# EAGLE board tsunami (EAGLE 7.7.0)
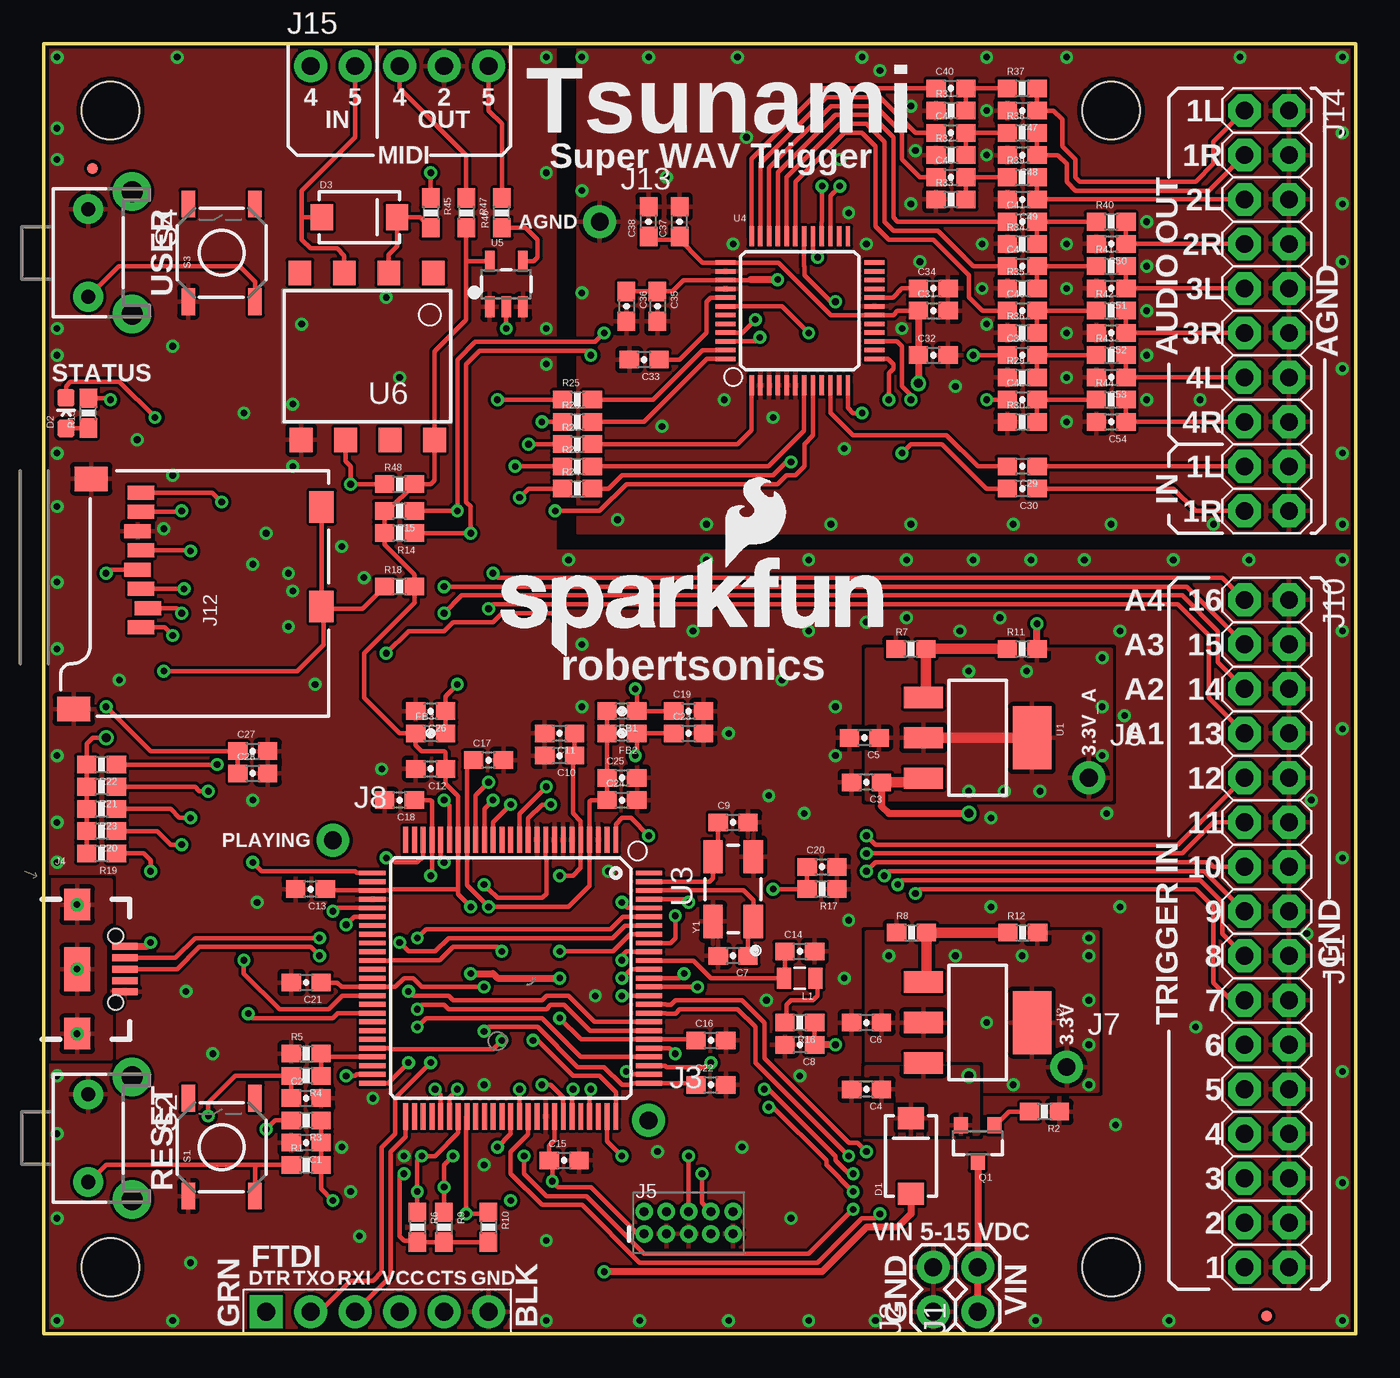
[diagram p2: board, top side]
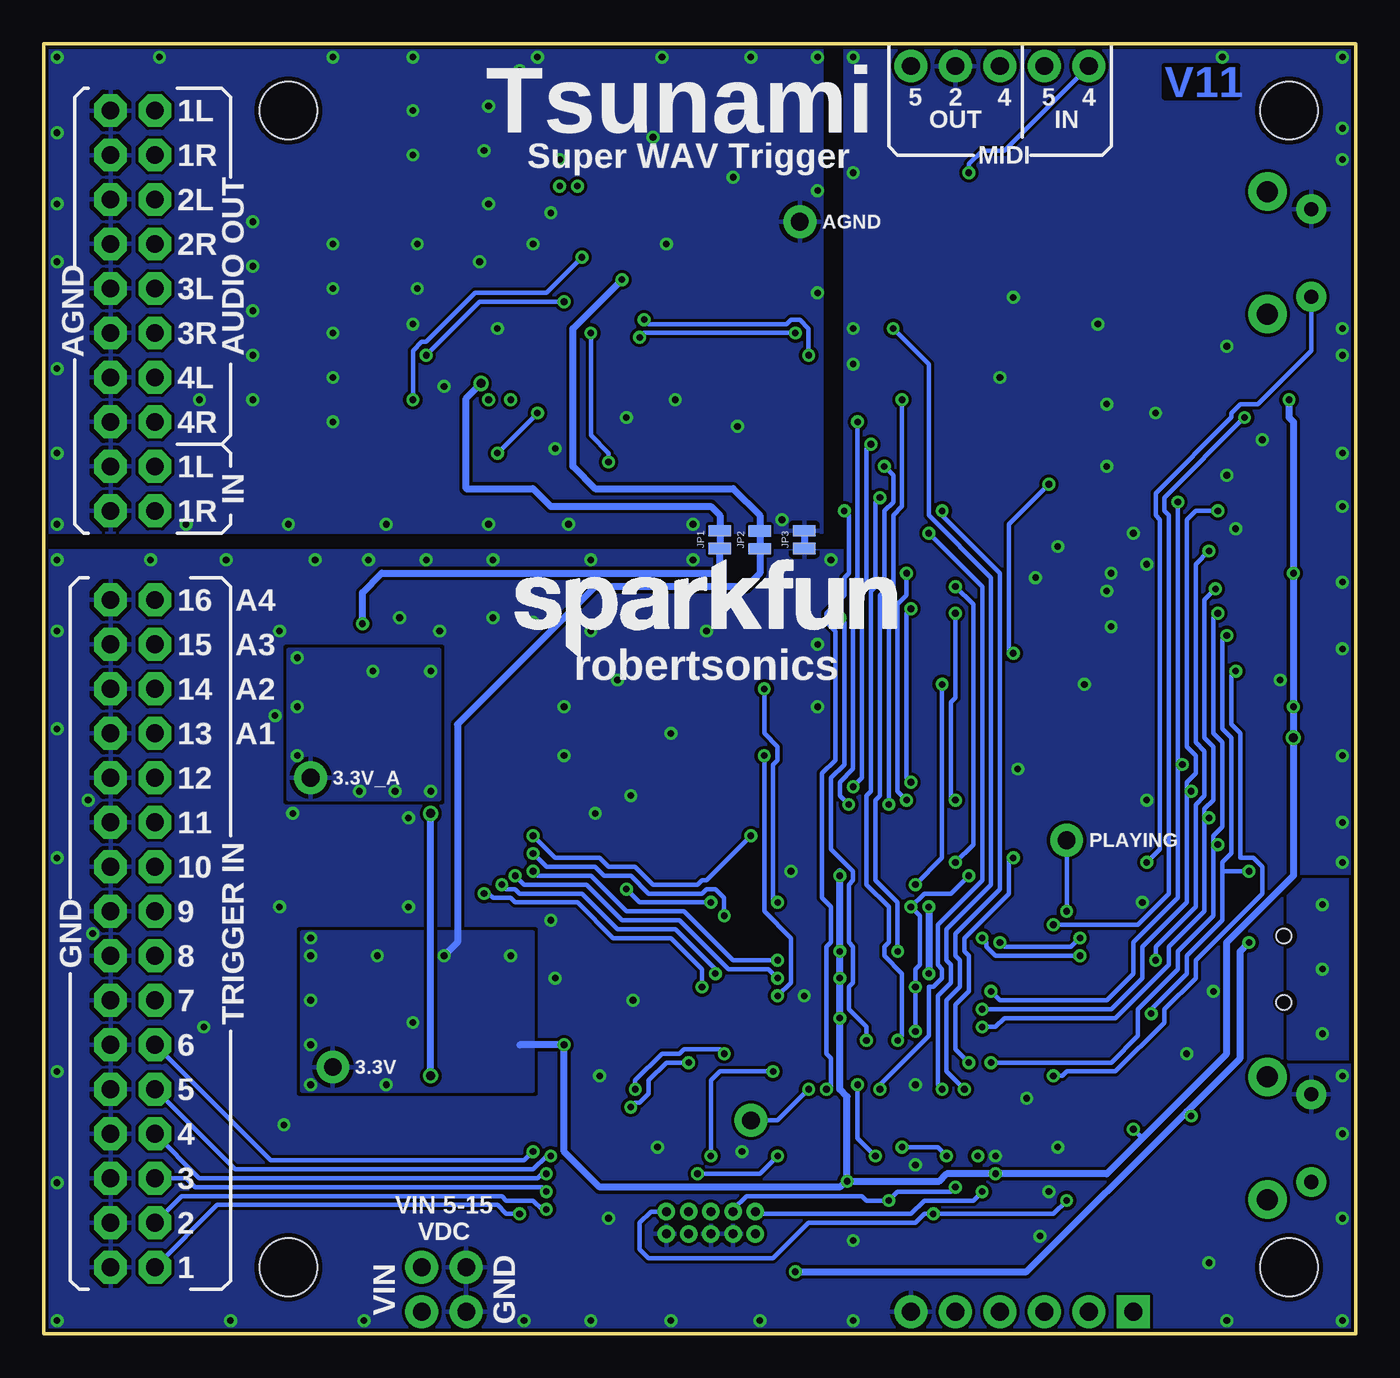
[diagram p3: board, bottom side, seen from below]

Size 74.93 x 73.66 mm. Coordinates in mm from the lower left corner, seen from the top.
Outline: 0,0 74.93,0 74.93,73.66 0,73.66 0,0
Copper layers (1*16): Top 0.035mm / dielectric 1.5mm / Bottom 0.035mm
Design rules "SparkFun-2-layer-TIGHT": minimum track width 7mil, minimum drill 15mil, track to track 7mil, track to pad 7mil, pad to pad 7mil, via to via 7mil, smd to smd 7mil, copper to edge 7mil, drill to drill 7mil, minimum pad ring 7mil, minimum via ring 7mil, stop-mask expansion 4mil, vias tented up to drill 20mil, thermal gap 10mil
tRestrict: area 41.1,53.7 to 41.3,54.5; area 41.7,53.7 to 41.8,54.5; area 42.2,53.7 to 42.3,54.5; area 42.7,53.7 to 42.8,54.5; area 29.3,27.8 to 29.5,28.6; area 29.8,27.8 to 30,28.6

## Footprints (pad centres in the part's own frame; a part is rotated, then mirrored left to right if it is on the bottom)
0603-CAP = smd 1.1 x 1: 1 -0.85,0; 2 0.85,0
SMA-DIODE = smd 1.27 x 1.47: A -2.15,0; C 2.15,0
LED-0603 = smd 1 x 1: A 0,-0.877; C 0,0.877
0603 = smd 1.1 x 1: 1 -0.85,0; 2 0.85,0
MICRO-FIDUCIAL = smd 0.635 x 0.635: 1 0,0
STAND-OFF = hole 3.302: 0,0
1X02 = drill 1.016 pad 1.88: 1 0,0; 2 2.54,0
1X01_NO_SILK = drill 1.016 pad 1.88: 1 0,0
USB-B-MICRO-SMD_V03 = smd 1.45 x 0.4: D+ 2.725,0; D- 2.725,0.65; GND 2.725,-1.3; ID 2.725,-0.65; VBUS 2.725,1.3 | smd 1.5 x 1.8: SHIELD1 0,3.685; SHIELD2 0,-3.685 | smd 1.5 x 2.5: SHIELD3 0,0 | hole 0.85: 2.2,1.9; 2.2,-1.9
2X5-PTH-1.27MM = drill 0.508 pad 1: 1 -2.54,-0.635; 2 -2.54,0.635; 3 -1.27,-0.635; 4 -1.27,0.635; 5 0,-0.635; 6 0,0.635; 7 1.27,-0.635; 8 1.27,0.635; 9 2.54,-0.635; 10 2.54,0.635
FTDI_DEVICE_SIDE = drill 1.016 pad 1.88 square: P$1 -6.35,0 | drill 1.016 pad 1.88: P$2 -3.81,0; P$3 -1.27,0; P$4 1.27,0; P$5 3.81,0; P$6 6.35,0
2X8 = drill 1.016 pad 1.88 octagon: 1 0,0; 2 0,2.54; 3 2.54,0; 4 2.54,2.54; 5 5.08,0; 6 5.08,2.54; 7 7.62,0; 8 7.62,2.54; 9 10.16,0; 10 10.16,2.54; 11 12.7,0; 12 12.7,2.54; 13 15.24,0; 14 15.24,2.54; 15 17.78,0; 16 17.78,2.54
MICRO-SD-SOCKET-SDIO = smd 1.8 x 1.4: CD1 11.92,0.4; CD2 6.22,0.4 | smd 0.8 x 1.5: CD/DAT3 6.13,10.3; CLK 9.43,10.7; CMD 7.23,10.7; DAT0 11.63,10.7; DAT1 12.73,10.7; DAT2 5.03,10.7; GND 10.53,10.9; VCC 8.33,10.9 | smd 1.4 x 1.9: GND1 0.37,14.55; GND3 13.52,13.55
2X10 = drill 1.016 pad 1.88 octagon: 1 -11.43,-1.27; 2 -11.43,1.27; 3 -8.89,-1.27; 4 -8.89,1.27; 5 -6.35,-1.27; 6 -6.35,1.27; 7 -3.81,-1.27; 8 -3.81,1.27; 9 -1.27,-1.27; 10 -1.27,1.27; 11 1.27,-1.27; 12 1.27,1.27; 13 3.81,-1.27; 14 3.81,1.27; 15 6.35,-1.27; 16 6.35,1.27; 17 8.89,-1.27; 18 8.89,1.27; 19 11.43,-1.27; 20 11.43,1.27
1X05_NO_SILK = drill 1.016 pad 1.88: 1 0,0; 2 2.54,0; 3 5.08,0; 4 7.62,0; 5 10.16,0
PAD-JUMPER-2-NC_BY_TRACE_NO_SILK = smd 0.635 x 1.27: 1 -0.508,0; 2 0.508,0
0805 = smd 0.8 x 1.2: 1 -0.9,0; 2 0.9,0
SOT23-3 = smd 0.8 x 0.9: 1 -0.95,-1; 2 0.95,-1; 3 0,1.1
0603-RES = smd 1.1 x 1: 1 -0.85,0; 2 0.85,0
TACTILE-SWITCH-SMD = smd 1.524 x 0.762: 1 -2.794,1.905; 2 2.794,1.905; 3 -2.794,-1.905; 4 2.794,-1.905
TACTILE-PTH-SIDEEZ = drill 0.8 pad 1.7: 1 -2.5,0; 2 2.5,0 | drill 1.2 pad 2.2: ANCHOR1 -3.5,2.5; ANCHOR2 3.5,2.5
TP_15TH = drill 0.381 pad 0.61: P$1 0,0
SOT223 = smd 1.219 x 2.235: 1 -2.311,-3.099; 2 0,-3.099; 3 2.311,-3.099 | smd 3.6 x 2.2: 4 0,3.099
LQFP100 = smd 1.5 x 0.28: 1 -7.9,6; 2 -7.9,5.5; 3 -7.9,5; 4 -7.9,4.5; 5 -7.9,4; 6 -7.9,3.5; 7 -7.9,3; 8 -7.9,2.5; 9 -7.9,2; 10 -7.9,1.5; 11 -7.9,1; 12 -7.9,0.5; 13 -7.9,0; 14 -7.9,-0.5; 15 -7.9,-1; 16 -7.9,-1.5; 17 -7.9,-2; 18 -7.9,-2.5; 19 -7.9,-3; 20 -7.9,-3.5; 21 -7.9,-4; 22 -7.9,-4.5; 23 -7.9,-5; 24 -7.9,-5.5; 25 -7.9,-6; 51 7.9,-6; 52 7.9,-5.5; 53 7.9,-5; 54 7.9,-4.5; 55 7.9,-4; 56 7.9,-3.5; 57 7.9,-3; 58 7.9,-2.5; 59 7.9,-2; 60 7.9,-1.5; 61 7.9,-1; 62 7.9,-0.5; 63 7.9,0; 64 7.9,0.5; 65 7.9,1; 66 7.9,1.5; 67 7.9,2; 68 7.9,2.5; 69 7.9,3; 70 7.9,3.5; 71 7.9,4; 72 7.9,4.5; 73 7.9,5; 74 7.9,5.5; 75 7.9,6 | smd 0.28 x 1.5: 26 -6,-7.9; 27 -5.5,-7.9; 28 -5,-7.9; 29 -4.5,-7.9; 30 -4,-7.9; 31 -3.5,-7.9; 32 -3,-7.9; 33 -2.5,-7.9; 34 -2,-7.9; 35 -1.5,-7.9; 36 -1,-7.9; 37 -0.5,-7.9; 38 0,-7.9; 39 0.5,-7.9; 40 1,-7.9; 41 1.5,-7.9; 42 2,-7.9; 43 2.5,-7.9; 44 3,-7.9; 45 3.5,-7.9; 46 4,-7.9; 47 4.5,-7.9; 48 5,-7.9; 49 5.5,-7.9; 50 6,-7.9; 76 6,7.9; 77 5.5,7.9; 78 5,7.9; 79 4.5,7.9; 80 4,7.9; 81 3.5,7.9; 82 3,7.9; 83 2.5,7.9; 84 2,7.9; 85 1.5,7.9; 86 1,7.9; 87 0.5,7.9; 88 0,7.9; 89 -0.5,7.9; 90 -1,7.9; 91 -1.5,7.9; 92 -2,7.9; 93 -2.5,7.9; 94 -3,7.9; 95 -3.5,7.9; 96 -4,7.9; 97 -4.5,7.9; 98 -5,7.9; 99 -5.5,7.9; 100 -6,7.9
LQFP-48 = smd 0.254 x 1.143: 1 -2.75,-4.25; 2 -2.25,-4.25; 3 -1.75,-4.25; 4 -1.25,-4.25; 5 -0.75,-4.25; 6 -0.25,-4.25; 7 0.25,-4.25; 8 0.75,-4.25; 9 1.25,-4.25; 10 1.75,-4.25; 11 2.25,-4.25; 12 2.75,-4.25; 25 2.75,4.25; 26 2.25,4.25; 27 1.75,4.25; 28 1.25,4.25; 29 0.75,4.25; 30 0.25,4.25; 31 -0.25,4.25; 32 -0.75,4.25; 33 -1.25,4.25; 34 -1.75,4.25; 35 -2.25,4.25; 36 -2.75,4.25 | smd 1.143 x 0.254: 13 4.25,-2.75; 14 4.25,-2.25; 15 4.25,-1.75; 16 4.25,-1.25; 17 4.25,-0.75; 18 4.25,-0.25; 19 4.25,0.25; 20 4.25,0.75; 21 4.25,1.25; 22 4.25,1.75; 23 4.25,2.25; 24 4.25,2.75; 37 -4.25,2.75; 38 -4.25,2.25; 39 -4.25,1.75; 40 -4.25,1.25; 41 -4.25,0.75; 42 -4.25,0.25; 43 -4.25,-0.25; 44 -4.25,-0.75; 45 -4.25,-1.25; 46 -4.25,-1.75; 47 -4.25,-2.25; 48 -4.25,-2.75
SOT23-5 = smd 0.55 x 1.2: 1 -0.95,-1.3; 2 0,-1.3; 3 0.95,-1.3; 4 0.95,1.3; 5 -0.95,1.3
8-SMD = smd 1.3 x 1.4: 1 -3.96,-4.96; 2 -1.42,-4.96; 3 1.12,-4.96; 4 3.66,-4.96; 5 3.59,4.58; 6 1.05,4.58; 7 -1.49,4.58; 8 -4.03,4.58
CRYSTAL-OSC-SMD-5X3 = smd 1.9 x 1.1: 1 -1.85,-1.15; 2 1.85,-1.15; 3 1.85,1.15; 4 -1.85,1.15

## Placement (x,y rotation side)
C1  10nF  [0603-CAP]  14.99,10.92 180 top
C2  10uF  [0603-CAP]  14.99,13.46 0 top
C3  0.1uF  [0603-CAP]  46.99,31.5 180 top
C4  0.1uF  [0603-CAP]  46.99,13.97 180 top
C5  10uF  [0603-CAP]  46.86,34.04 180 top
C6  10uF  [0603-CAP]  46.99,17.78 180 top
C7  12pF  [0603-CAP]  39.37,21.59 180 top
C8  0.1uF  [0603-CAP]  43.18,16.51 180 top
C9  12pF  [0603-CAP]  39.37,29.21 0 top
C10  0.1uF  [0603-CAP]  29.46,33.02 180 top
C11  10uF  [0603-CAP]  29.46,34.29 180 top
C12  0.1uF  [0603-CAP]  22.1,32.26 180 top
C13  0.1uF  [0603-CAP]  15.24,25.4 180 top
C14  4.7uF  [0603-CAP]  43.18,21.84 0 top
C15  0.1uF  [0603-CAP]  29.72,9.91 0 top
C16  0.1uF  [0603-CAP]  38.1,16.76 0 top
C17  0.1uF  [0603-CAP]  25.4,32.77 0 top
C18  0.1uF  [0603-CAP]  20.32,30.48 180 top
C19  0.1uF  [0603-CAP]  36.83,35.56 0 top
C20  10pF  [0603-CAP]  44.45,26.67 0 top
C21  0.1uF  [0603-CAP]  14.99,20.07 180 top
C22  0.1uF  [0603-CAP]  38.1,14.22 0 top
C23  0.1uF  [0603-CAP]  36.83,34.29 0 top
C24  0.1uF  [0603-CAP]  33.02,30.48 0 top
C25  2.2uF  [0603-CAP]  33.02,31.75 0 top
C26  0.1uF  [0603-CAP]  22.1,35.56 180 top
C27  10uF  [0603-CAP]  11.94,33.27 0 top
C28  0.1uF  [0603-CAP]  11.94,32 0 top
C29  1.0uF  [0603-CAP]  55.88,49.53 180 top
C30  1.0uF  [0603-CAP]  55.88,48.26 180 top
C31  0.1uF  [0603-CAP]  50.8,58.42 0 top
C32  1.0uF  [0603-CAP]  50.8,55.88 0 top
C33  1.0uF  [0603-CAP]  34.29,55.63 180 top
C34  1.0uF  [0603-CAP]  50.8,59.69 0 top
C35  0.1uF  [0603-CAP]  35.05,58.67 270 top
C36  1.0uF  [0603-CAP]  33.27,58.67 270 top
C37  0.1uF  [0603-CAP]  36.32,63.5 90 top
C38  1.0uF  [0603-CAP]  34.54,63.5 90 top
C39  1.0uF  [0603-CAP]  55.88,55.88 0 top
C40  1.0uF  [0603-CAP]  51.82,71.12 0 top
C41  1.0uF  [0603-CAP]  55.88,63.5 0 top
C42  1.0uF  [0603-CAP]  55.88,53.34 0 top
C43  1.0uF  [0603-CAP]  51.82,68.58 0 top
C44  1.0uF  [0603-CAP]  55.88,60.96 0 top
C45  1.0uF  [0603-CAP]  51.82,66.04 0 top
C46  1.0uF  [0603-CAP]  55.88,58.42 0 top
C47  0.1uF  [0603-CAP]  55.88,69.85 180 top
C48  0.1uF  [0603-CAP]  55.88,67.31 180 top
C49  0.1uF  [0603-CAP]  55.88,64.77 180 top
C50  0.1uF  [0603-CAP]  60.96,62.23 180 top
C51  0.1uF  [0603-CAP]  60.96,59.69 180 top
C52  0.1uF  [0603-CAP]  60.96,57.15 180 top
C53  0.1uF  [0603-CAP]  60.96,54.61 180 top
C54  0.1uF  [0603-CAP]  60.96,52.07 180 top
D1  MBRA140  [SMA-DIODE]  49.53,10.16 90 top
D2  BLUE  [LED-0603]  1.27,52.58 0 top
D3  MBRA140  [SMA-DIODE]  18.03,63.75 0 top
FB1  470  [0603]  33.02,35.56 180 top
FB2  470  [0603]  33.02,34.29 180 top
FB3  470  [0603]  22.1,34.29 0 top
FD1  FIDUCIALUFIDUCIAL  [MICRO-FIDUCIAL]  69.85,1.02 0 top
FD2  FIDUCIALUFIDUCIAL  [MICRO-FIDUCIAL]  2.79,66.55 0 top
FRAME1  FRAME-LEDGER  [CREATIVE_COMMONS]  -1.27,-31.75 0 top  (outside the outline)
FRAME2  FRAME-LEDGER  [CREATIVE_COMMONS]  -1.27,-31.75 0 top  (outside the outline)
H1  STAND-OFF  [STAND-OFF]  3.81,69.85 0 top
H2  STAND-OFF  [STAND-OFF]  60.96,3.81 0 top
H3  STAND-OFF  [STAND-OFF]  3.81,3.81 0 top
H4  STAND-OFF  [STAND-OFF]  60.96,69.85 0 top
J1  VDC-IN  [1X02]  53.34,1.27 90 top
J2  GND-IN  [1X02]  50.8,1.27 90 top
J3  DEBUG  [1X01_NO_SILK]  34.54,12.19 0 top
J4  USB-MICROB"  [USB-B-MICRO-SMD_V03]  1.91,20.83 0 top
J5  CORTEX_DEBUGPTH  [2X5-PTH-1.27MM]  36.83,6.35 0 top
J6  3.3VA  [1X01_NO_SILK]  59.69,31.75 0 top
J7  3.3V  [1X01_NO_SILK]  58.42,15.24 0 top
J8  PLAYING  [1X01_NO_SILK]  16.51,28.19 0 top
J9  FTDI_DEVICE  [FTDI_DEVICE_SIDE]  19.05,1.27 0 top
J10  TRIG2  [2X8]  68.58,41.91 270 top
J11  TRIG1  [2X8]  68.58,21.59 270 top
J12  USD-SDIO-SOCKET  [MICRO-SD-SOCKET-SDIO]  16.26,35.31 90 top
J13  GND  [1X01_NO_SILK]  31.75,63.5 0 top
J14  AUDIO I/O  [2X10]  69.85,58.42 270 top
J15  MIDI  [1X05_NO_SILK]  15.24,72.39 0 top
JP1  JUMPER-PAD-2-NC_BY_TRACENO_SILK  [PAD-JUMPER-2-NC_BY_TRACE_NO_SILK]  36.32,45.35 90 bottom
JP2  JUMPER-PAD-2-NC_BY_TRACENO_SILK  [PAD-JUMPER-2-NC_BY_TRACE_NO_SILK]  34.04,45.34 90 bottom
JP3  JUMPER-PAD-2-NC_BY_TRACENO_SILK  [PAD-JUMPER-2-NC_BY_TRACE_NO_SILK]  31.5,45.35 90 bottom
L1  10uH  [0805]  43.18,20.32 180 top
LOGO1  SFE_LOGO_NAME.2_INCH  [SFE_LOGO_NAME_.2]  48.01,38.61 0 bottom
LOGO4  SFE_LOGO_NAME_FLAME.2_INCH  [SFE_LOGO_NAME_FLAME_.2]  25.4,38.61 0 top
Q1  2.5A/30V  [SOT23-3]  53.34,10.92 180 top
R1  33  [0603-RES]  14.99,9.65 0 top
R2  1M  [0603-RES]  57.15,12.7 180 top
R3  10K  [0603-RES]  14.99,12.19 180 top
R4  15K  [0603-RES]  14.99,14.73 180 top
R5  22K  [0603-RES]  14.99,16 0 top
R6  100k  [0603-RES]  21.34,6.1 270 top
R7  390  [0603-RES]  49.53,39.12 0 top
R8  390  [0603-RES]  49.56,22.91 0 top
R9  100k  [0603-RES]  22.86,6.1 270 top
R10  100k  [0603-RES]  25.4,6.1 270 top
R11  240  [0603-RES]  55.88,39.12 0 top
R12  240  [0603-RES]  55.91,22.91 0 top
R13  330  [0603-RES]  2.54,52.58 90 top
R14  4.7K  [0603-RES]  20.32,45.72 180 top
R15  4.7K  [0603-RES]  20.32,46.99 180 top
R16  2.2  [0603-RES]  43.18,17.78 180 top
R17  5.62k  [0603-RES]  44.45,25.4 180 top
R18  10K  [0603-RES]  20.32,42.67 0 top
R19  100k  [0603-RES]  3.3,27.43 180 top
R20  100k  [0603-RES]  3.3,28.7 180 top
R21  100k  [0603-RES]  3.3,31.24 180 top
R22  100k  [0603-RES]  3.3,32.51 180 top
R23  10K  [0603-RES]  3.3,29.97 180 top
R24  100  [0603-RES]  30.48,48.26 0 top
R25  100  [0603-RES]  30.48,53.34 0 top
R26  100  [0603-RES]  30.48,52.07 0 top
R27  100  [0603-RES]  30.48,50.8 0 top
R28  100  [0603-RES]  30.48,49.53 0 top
R29  100k  [0603-RES]  55.88,54.61 0 top
R30  100k  [0603-RES]  55.88,52.07 0 top
R31  100k  [0603-RES]  51.82,69.85 0 top
R32  100k  [0603-RES]  51.82,67.31 0 top
R33  100k  [0603-RES]  51.82,64.77 0 top
R34  100k  [0603-RES]  55.88,62.23 0 top
R35  100k  [0603-RES]  55.88,59.69 0 top
R36  100k  [0603-RES]  55.88,57.15 0 top
R37  10  [0603-RES]  55.88,71.12 0 top
R38  10  [0603-RES]  55.88,68.58 0 top
R39  10  [0603-RES]  55.88,66.04 0 top
R40  10  [0603-RES]  60.96,63.5 0 top
R41  10  [0603-RES]  60.96,60.96 0 top
R42  10  [0603-RES]  60.96,58.42 0 top
R43  10  [0603-RES]  60.96,55.88 0 top
R44  10  [0603-RES]  60.96,53.34 0 top
R45  220  [0603-RES]  22.1,64.01 270 top
R46  220  [0603-RES]  26.16,64.01 90 top
R47  220  [0603-RES]  24.13,64.01 270 top
R48  220  [0603-RES]  20.32,48.51 0 top
S1  Reset  [TACTILE-SWITCH-SMD]  10.16,10.67 90 top
S2  DNS  [TACTILE-PTH-SIDEEZ]  2.54,11.18 270 top
S3  User  [TACTILE-SWITCH-SMD]  10.16,61.72 90 top
S4  DNS  [TACTILE-PTH-SIDEEZ]  2.54,61.72 270 top
TP1  AIN2L  [TP_15TH]  48.26,53.34 0 top
TP2  AIN2R  [TP_15TH]  49.53,53.34 0 top
TP3  AOUT5L  [TP_15TH]  44.45,65.53 90 top
TP4  AOUT5R  [TP_15TH]  45.47,65.53 90 top
TP5  SWDIO/TMS  [TP_15TH]  21.59,10.16 90 top
TP6  SWCK/TCK  [TP_15TH]  26.67,7.62 90 top
TP7  TDO  [TP_15TH]  36.83,10.16 90 top
TP8  TDI  [TP_15TH]  33.02,10.16 90 top
TP9  NRESET  [TP_15TH]  16.51,7.62 0 top
U1  LM1117  [SOT223]  53.34,34.04 270 top
U2  LM1117  [SOT223]  53.34,17.78 270 top
U3  ATSAMS70N20A-AN  [LQFP100]  26.67,20.32 270 top
U4  AK4618VQ  [LQFP-48]  43.18,58.42 0 top
U5  74AHC1G125  [SOT23-5]  26.42,59.94 0 top
U6  6N138M  [8-SMD]  18.29,55.63 180 top
Y1  11.2896 MHz  [CRYSTAL-OSC-SMD-5X3]  39.37,25.4 90 top

## Tracks (layer width: path | path; a pad name or v marks a point on that pad's centre or on a via)
3.3V  (via drill 0.38, 0.51)
  Top 0.254: C16.1 37.19,16.82 U3.81 30.68,16.82 v29.46,18.03 | C11.1 C10.1 30.23,32.93 30.23,29.72 30.67,29.27 U3.5 30.67,26.61 30.23,26.16 v29.46,26.16 | R16.1 C8.1 | C36.1 C35.1 35.9,59.52 36.55,60.17 U4.39 40.36,60.17 40.39,60.2 | C13.1 16.17,25.32 U3.28 19.73,25.32 19.81,25.4 23.67,25.4 | C28.1 C27.1 6.1,33.27 v3.56,35.81 | U3.93 33.49,22.82 32.51,21.84 v29.46,21.84 | 23.67,25.4 U3.19 23.67,30.69 22.95,31.41 C12.1 22.95,33.19 22.86,33.27 21.59,33.27 21.25,33.62 FB3.1 20.32,34.29 18.29,36.32 18.29,38.86 21.17,41.74 R18.2 21.17,43.35 19.47,45.05 R14.2 R15.2 19.65,46.99 R48.2 22.1,48.51 22.32,48.73 U6.8 22.32,56.1 24.13,57.91 24.13,61.21 | 23.67,25.4 23.67,25.1 v24.38,24.38 | J12.VCC 3.76,43.64 v3.56,43.43 | R13.2 3.72,53.43 v3.81,53.34 | R19.2 R20.2 R23.2 R21.2 R22.2 2.45,33.69 2.79,34.04 v3.56,34.04 | R10.2 22.95,5.25 22.86,5.33 R9.2 R6.2 21.34,5.33 20.57,5.33 20.32,5.59 20.32,9.14 v20.57,9.14 | U3.68 29.17,11.05 28.87,10.75 C15.1 29.04,9.73 v29.04,8.72 29.39,8.38 31.24,8.38 33.91,5.71 J5.1 | R3.2 13.21,12.19 v12.7,11.68 | U5.5 24.16,61.24 24.13,61.21 | 24.13,61.21 R47.2
  Top 0.406: C36.1 33.11,59.69 | v45.21,16.51 C8.1 | v41.91,60.2 40.39,60.2 | v24.38,20.57 25.65,20.57 25.91,20.32 v29.46,20.32
  Top 0.61: 56.76,18.12 arc-90 U2.4
  Bottom 0.254: v12.7,11.68 12.19,11.18
  Bottom 0.406: v29.04,8.72 29.12,8.72 29.46,8.38 43.18,8.38 45.21,10.41 v45.21,16.51 47.75,16.51 | v41.91,60.2 44.7,57.4 44.7,49.53 43.43,48.26 35.56,48.26 34.04,46.74 JP2.2 JP2.1 34.04,43.43 34.8,42.67 43.43,42.67 51.31,34.8 51.31,22.35 v52.07,21.59 | v29.04,8.72 29.04,13.55 29.46,13.97 v29.46,18.03 v29.46,20.32 v29.46,21.84 v29.46,26.16 29.46,26.42 | v24.38,24.38 v24.38,20.57 | v3.81,53.34 3.81,52.32 3.56,52.07 v3.56,43.43 v3.56,35.81 v3.56,34.04 3.56,26.16 7.37,22.35 7.37,16 12.19,11.18 14.22,9.14 v20.57,9.14 23.37,9.14 23.79,8.72 v29.04,8.72
  other vias: 53.85,17.78 59.69,14.22 55.37,14.22 59.69,16.51 59.69,19.05 59.69,21.59 55.88,21.59 48.26,21.59 59.69,22.61
  pour Top (rank 2): 46.99,13.84 46.99,22.99 60.2,22.99 60.2,13.84
  pour Bottom: 60.2,13.84 60.2,22.99 46.99,22.99 46.99,13.84
56
  Top 0.254: R45.2 21.5,63.75 D3.C 20.18,62.09 19.71,61.62 U6.2
AIN1L
  Top 0.254: C29.1 J14.17
AIN1R
  Top 0.254: J14.19 65.79,46.99 64.52,48.26 C30.1
AIN2L
  Top 0.254: U4.13 48.22,55.67 48.51,55.37 48.51,55.12 48.26,54.86 TP1.P$1
AIN2R
  Top 0.254: U4.15 48.74,56.67 49.02,56.39 49.02,54.1 49.53,53.59 TP2.P$1
AOUT1L
  Top 0.254: R37.2 C47.1 57.66,69.85 58.17,69.34 58.17,67.82 58.93,67.06 58.93,66.04 59.18,65.79 65.79,65.79 66.8,66.8 66.8,68.07 J14.1
AOUT1R
  Top 0.254: R38.2 C48.1 57.91,67.31 58.42,66.8 58.42,65.79 58.93,65.28 66.55,65.28 J14.3
AOUT2L
  Top 0.254: R39.2 C49.1 J14.5
AOUT2R
  Top 0.254: R40.2 C50.1 J14.7
AOUT3L
  Top 0.254: R41.2 C51.1 J14.9
AOUT3R
  Top 0.254: R42.2 C52.1 J14.11
AOUT4L
  Top 0.254: R43.2 C53.1 J14.13
AOUT4R
  Top 0.254: C54.1 61.81,52.58 | 61.81,52.58 R44.2 | J14.15 62.32,52.07 61.81,52.58
APDN  (via drill 0.38)
  Top 0.254: U3.70 30.17,13.66 30.23,13.72 v30.23,13.97 | v29.21,46.99 31.75,46.99 33.27,48.51 41.91,48.51 42.42,49.02 42.93,49.02 43.43,49.53 43.43,50.8 43.94,51.31 43.94,53.34 43.93,53.35 U4.8
  Bottom 0.254: v30.23,13.97 29.97,13.97 29.97,15.75 30.23,16 30.23,22.1 29.97,22.35 29.97,24.38 30.48,24.89 30.48,32 29.72,32.77 29.72,40.13 30.23,40.64 30.23,41.15 29.21,42.16 29.21,43.18 28.96,43.43 28.96,46.74 v29.21,46.99
BCLK  (via drill 0.38)
  Top 0.254: U3.11 27.67,29.45 28.45,30.23 v28.96,30.23 | R26.1 v28.45,52.07
  Bottom 0.254: v28.96,30.23 29.46,30.73 29.46,31.5 28.7,32.26 28.7,42.93 28.45,43.18 v28.45,52.07
BCLK_C
  Top 0.254: U4.48 37.89,55.67 34.29,52.07 R26.2
DBUG  (via drill 0.38)
  Top 0.254: U3.72 31.17,13.9 v31.24,13.97
  Bottom 0.254: J3.1 33.02,12.19 v31.24,13.97
GND  (via drill 0.38)
  Top 0.254: 43.24,14.79 v43.18,14.73
  Bottom 0.406: JP3.2 JP3.1
  other vias: 53.59,59.69 62.99,58.42 62.99,60.96 62.99,63.5 62.99,55.88 62.99,53.34 47.75,72.14 40.13,68.33 45.97,64.01 46.99,62.23 45.47,67.06 49.02,57.4 7.37,0.76 0.76,6.6 39.12,0.76 43.69,0.76 30.73,35.81 32.26,26.42 39.12,34.29 42.16,37.34 46.99,40.64 52.32,40.13 45.21,35.81 45.21,33.02 41.4,30.73 43.43,29.72 61.47,40.13 59.44,44.2 56.39,44.2 53.09,44.2 49.28,44.2 43.69,44.2 37.85,44.2 29.97,44.2 14.22,53.09 19.56,59.18 14.22,49.53 13.97,43.43 18.29,43.18 0.76,67.06 20.32,54.61 53.85,57.66 52.07,54.1 32.77,46.48 37.85,46.23 49.53,46.23 66.8,46.23 66.04,53.34 39.37,62.23 30.73,65.28 30.73,72.9 35.56,66.04 39.62,72.9 46.74,72.9 53.85,72.9 74.17,64.52 74.17,68.58 74.17,55.12 74.17,50.29 74.17,40.13 68.83,44.2 74.17,44.2 45.72,50.55 28.7,66.29 28.7,72.9 7.62,72.9 0.76,68.83 74.17,34.54 74.17,27.18 74.17,14.99 74.17,8.64 30.73,39.37 37.08,40.13 43.69,40.13 49.28,40.89 54.61,40.89 17.02,44.96 0.76,47.24 74.17,72.9 74.17,46.23 74.17,0.76 64.26,0.76 0.76,0.76 0.76,39.12 0.76,33.02 4.32,37.34 0.76,42.93 11.94,43.94 12.7,45.72 14.22,42.42 13.97,40.39 11.94,30.48 8.38,4.06 72.39,30.48 72.14,22.86 5.33,51.05 7.37,49.02 6.86,45.97 58.42,62.23 58.42,59.69 58.42,57.15 58.42,54.61 58.42,52.07 17.02,10.67 17.53,8.13 45.72,20.32 42.67,6.6 39.88,10.67 28.7,5.33 25.15,14.22 31.5,19.3 28.7,57.4 28.7,55.37 49.53,70.1 49.53,64.52 49.78,67.56 53.85,69.85 53.85,67.31 53.59,62.23 0.76,72.9 0.76,57.4 0.76,55.88 7.37,56.39 11.43,52.58 14.73,57.66 0.76,29.21 0.76,26.92 34.04,0.76 28.7,0.76 47.5,0.76 35.05,10.41 25.15,9.65 20.57,10.16 18.8,13.46 18.03,5.59 56.64,0.76 61.21,11.94 65.79,17.53 61.47,24.38 54.1,24.38 45.97,23.62 54.1,29.46 60.71,29.72 61.72,35.31 64.52,44.2 60.96,46.23 55.37,46.23 44.96,46.23 74.17,61.21 68.33,72.9 58.42,72.9 30.73,59.44 50.04,61.21 41.66,52.32 38.86,53.34 35.31,51.82 19.3,32.26 15.49,37.08 12.19,24.64 8.13,19.56 9.65,16 41.27,19.05 0.76,50.29 0.76,11.43 0.76,14.73 34.54,72.9
  pour Top (rank 3): 0,73.66 29.21,73.66 29.21,44.72 74.93,44.72 74.93,0 0,0
  pour Top: 30.48,73.66 30.48,45.74 74.93,45.74 74.93,73.66
  pour Bottom (rank 2): 0,73.66 29.21,73.66 29.21,44.72 74.93,44.72 74.93,0 0,0
  pour Bottom: 30.48,73.66 30.48,45.74 74.93,45.74 74.93,73.66
HSDM  (via drill 0.38)
  Top 0.254: U3.94 33.21,23.32 32.5,22.61 23.11,22.61 22.35,21.84 20.83,21.84 v20.32,22.35 | J4.D- 7.51,21.48 8.64,22.61 v15.75,22.61
  Bottom 0.254: v15.75,22.61 16.26,22.1 20.07,22.1 v20.32,22.35
HSDP  (via drill 0.38)
  Top 0.254: U3.95 33.07,23.82 32.36,23.11 21.84,23.11 v21.34,22.61 | J4.D+ 7.62,20.83 8.89,22.1 15.24,22.1 v15.75,21.59
  Bottom 0.254: v15.75,21.59 20.57,21.59 21.08,22.1 21.08,22.35 v21.34,22.61
I2C_SCK  (via drill 0.38)
  Top 0.254: U4.46 40.67,56.67 v40.89,56.9 | R15.1 v23.62,46.99 23.62,55.63 24.64,56.64 31.5,56.64 v32,57.15 | U3.55 22.67,13.65 v22.35,13.97
  Bottom 0.254: v32,57.15 40.64,57.15 v40.89,56.9 | v22.35,13.97 23.37,14.99 23.37,19.05 22.61,19.81 22.61,21.34 22.86,21.59 22.86,22.86 20.32,25.4 20.32,43.43 23.62,46.74 v23.62,46.99
I2C_SDA  (via drill 0.38)
  Top 0.254: v40.64,57.91 39.9,57.17 U4.45 | R14.1 v24.38,45.72 24.38,47.24 24.13,47.5 24.13,55.37 24.89,56.13 31.24,56.13 v31.24,55.88 | U3.64 v27.17,13.96 v27.18,13.97
  Bottom 0.254: v40.64,57.91 40.39,57.66 32.51,57.66 32.26,57.91 31.75,57.91 31.24,57.4 v31.24,55.88 | v27.18,13.97 27.18,14.22 24.38,17.02 24.38,19.81 24.13,19.81 23.62,20.32 23.62,20.83 23.88,21.08 23.88,23.37 21.34,25.91 21.34,42.67 v24.38,45.72
LRCK  (via drill 0.38)
  Top 0.254: U3.12 27.17,29.71 v28.7,31.24 | R27.1 v27.69,50.8
  Bottom 0.254: v28.7,31.24 28.19,31.75 28.19,42.67 27.94,42.93 27.94,50.55 v27.69,50.8
LRCK_C
  Top 0.254: U4.1 40.43,51.61 39.62,50.8 R27.2
MCLK  (via drill 0.38)
  Top 0.254: R25.1 v25.91,53.34 | U3.15 25.67,29.23 v26.67,30.23
  Bottom 0.254: v26.67,30.23 26.67,41.91 26.42,42.16 26.42,46.74 25.91,47.24 v25.91,53.34
MCLK_C
  Top 0.254: U4.47 37.63,56.17 34.8,53.34 R25.2
MIDI-IN-PIN4  (via drill 0.38)
  Top 0.254: v22.1,66.29 R45.1
  Bottom 0.254: v22.1,66.29 22.1,66.8 21.34,67.56 20.07,67.56 J15.1
MIDI-IN-PIN5
  Top 0.254: 14.73,63.75 14.73,62.48 15.24,61.98 16.76,61.98 17.17,61.57 U6.3 | 14.73,63.75 14.73,65.28 17.78,68.33 J15.2 | D3.A 14.73,63.75
MIDI-OUT-PIN4
  Top 0.254: R47.1 24.13,67.31 20.32,71.12 J15.3
MIDI-OUT-PIN5
  Top 0.254: R46.2 26.16,69.09 25.4,69.85 J15.5
MIN  (via drill 0.38)
  Top 0.254: U3.75 32.67,13.81 31.75,14.73 30.23,14.73 28.19,16.76 v27.94,16.76 | v29.46,40.89 29.21,41.15 26.16,41.15 25.65,40.64 23.37,40.64 22.86,40.13 20.83,40.13 v19.56,38.86 | R48.1 v17.53,48.51 17.53,49.53 17.24,49.82 U6.6
  Bottom 0.254: v27.94,16.76 27.94,17.53 28.96,18.54 28.96,19.81 28.7,20.07 28.7,22.1 28.96,22.35 28.96,25.65 28.7,25.91 28.7,26.42 29.97,27.69 29.97,31.75 29.21,32.51 29.21,40.64 v29.46,40.89 | v19.56,38.86 19.81,38.86 19.81,46.23 v17.53,48.51
MOUT  (via drill 0.38)
  Top 0.254: U3.56 23.17,13.52 v23.62,13.97 | U5.2 v26.42,57.4
  Bottom 0.254: v23.62,13.97 23.88,14.22 23.88,19.3 23.11,20.07 23.11,21.08 23.37,21.34 23.37,23.11 20.83,25.65 20.83,43.18 24.38,46.74 24.38,55.37 v26.42,57.4
N$1
  Top 0.254: U3.98 39.96,25.32 40.52,24.76 Y1.1 40.22,23.25 C7.1
N$2
  Top 0.254: U3.99 38.01,25.82 38.22,26.03 Y1.3 38.52,27.55 C9.1
N$3  (via drill 0.38)
  Top 0.254: C19.1 FB1.1 33.87,36.74 v33.78,36.83 | U3.96 33.34,24.32 v33.02,24.64
  Bottom 0.254: v33.02,24.64 33.27,24.64 33.27,32.51 33.02,32.77 33.02,33.53 33.78,34.29 v33.78,36.83
N$4
  Top 0.254: U3.90 37.1,21.32 38.1,20.32 L1.2 42.33,20.37 C14.1
N$5  (via drill 0.38)
  Top 0.254: C23.1 FB2.1 33.87,33.11 v33.78,33.02 | U3.86 33.04,19.32 v33.02,19.3
  Bottom 0.254: v33.78,33.02 33.78,24.13 32.26,22.61 32.26,20.07 v33.02,19.3
N$6
  Top 0.254: C33.1 36.32,55.63 37.85,57.15 37.85,58.93 38.09,59.17 U4.41
N$8  (via drill 0.38)
  Top 0.254: U3.30 16.7,24.32 v16.51,24.13
  Bottom 0.254: v16.51,24.13 J8.1
N$10  (via drill 0.38)
  Top 0.254: U3.31 17.72,23.82 v17.27,23.37 | v6.35,52.32 4.32,54.36 1.52,54.36 1.27,54.1 D2.C
  Bottom 0.254: v6.35,52.32 10.92,47.75 10.92,46.99 10.67,46.74 10.67,25.15 12.45,23.37 v17.27,23.37
N$11
  Top 0.254: D2.A 2.51,51.7 R13.1
N$12
  Top 0.254: C34.1 49.02,59.69 48.5,59.17 U4.20
N$13
  Top 0.254: U4.36 40.43,67.1 44.45,71.12 C40.1
N$14  (via drill 0.38)
  Top 0.254: U4.12 45.93,52.88 46.23,52.58 v46.74,52.58 | v49.02,50.29 49.53,50.8 51.31,50.8 53.85,48.26 C30.2
  Bottom 0.254: v46.74,52.58 v49.02,50.29
N$15
  Top 0.254: U4.10 44.93,52.61 46.23,51.31 51.56,51.31 53.34,49.53 C29.2
N$16  (via drill 0.38)
  Top 0.254: C20.1 R17.2 v41.66,25.4 | U3.97 36.65,24.82 v36.83,24.64
  Bottom 0.254: v41.66,25.4 40.89,24.64 v36.83,24.64
N$17  (via drill 0.38)
  Top 0.254: FB3.2 C26.1 22.95,36.41 v23.62,37.08 | U3.9 28.67,27.21 28.7,27.18 28.7,25.15 28.45,24.89 25.91,24.89 25.4,25.4 25.15,25.4 v25.15,25.65
  Bottom 0.254: v25.15,25.65 23.62,27.18 v23.62,37.08
N$18
  Top 0.254: C43.1 49.78,68.58 47.75,70.61 44.7,70.61 40.93,66.84 U4.35
N$19
  Top 0.254: C45.1 50.04,66.04 49.02,67.06 49.02,68.58 47.5,70.1 44.96,70.1 41.43,66.58 U4.34
N$20
  Top 0.254: U4.33 41.93,66.31 45.21,69.6 47.24,69.6 48.51,68.33 48.51,63.75 48.77,63.5 C41.1
N$21
  Top 0.254: C44.1 53.09,60.96 51.05,62.99 48.51,62.99 48.01,63.5 48.01,68.07 46.99,69.09 45.47,69.09 42.43,66.05 U4.32
N$22
  Top 0.254: C46.1 53.59,58.42 52.83,59.18 52.83,60.45 50.8,62.48 48.26,62.48 47.5,63.25 47.5,67.82 46.74,68.58 45.72,68.58 42.93,65.79 U4.31
N$23
  Top 0.254: R31.2 C40.2 R37.1
N$24
  Top 0.254: L1.1 44.2,20.32 44.2,19.3 43.94,19.05 42.67,19.05 42.42,18.8 42.42,17.78 R16.2
N$25
  Top 0.61: R11.1 R7.2 50.38,36.49 U1.1
N$26
  Top 0.254: S2.2 2.58,8.68 3.56,9.65 12.19,9.65 | R1.1 12.19,9.65 | S1.3 12.06,9.53 12.19,9.65
N$27
  Top 0.254: R44.1 C42.2 R30.2
N$28
  Top 0.254: R43.1 C39.2 R29.2
N$29
  Top 0.61: R12.1 R8.2 50.41,20.26 U2.1
N$30
  Top 0.254: R36.2 C46.2 R42.1
N$31  (via drill 0.38)
  Top 0.254: U4.30 43.43,60.96 43.43,60.45 44.96,58.93 v45.21,58.93 | v53.09,55.88 C39.1
  Bottom 0.254: v53.09,55.88 50.04,58.93 v45.21,58.93
N$32  (via drill 0.38)
  Top 0.254: U4.29 43.93,61.73 v44.2,61.47 | v53.85,53.34 C42.1
  Bottom 0.254: v53.85,53.34 53.85,56.13 53.34,56.64 53.09,56.64 50.29,59.44 46.23,59.44 v44.2,61.47
N$33
  Top 0.254: U4.28 44.43,63.48 44.45,63.5 TP3.P$1
N$34
  Top 0.254: U4.27 44.93,65 TP4.P$1
N$38
  Top 0.254: U5.4 27.97,61.24 28.19,61.47 28.19,62.48 27.52,63.16 R46.1
N$52
  Top 0.254: R35.2 C44.2 R41.1
N$53
  Top 0.254: R34.2 C41.2 R40.1
N$54
  Top 0.254: R32.2 C43.2 R38.1
N$55
  Top 0.254: R33.2 C45.2 R39.1
N$75
  Top 0.254: 56.03,12.43 R2.2 55.12,12.7 54.34,11.92 Q1.1
NRESET  (via drill 0.38)
  Top 0.254: R3.1 C1.1 R1.2 15.84,8.29 TP9.P$1 | U3.58 24.13,12.38 v24.13,6.86 25.31,6.86 R10.1
  Bottom 0.254: TP9.P$1 17.27,6.86 v24.13,6.86 24.64,6.86 25.15,6.35 31.24,6.35 33.27,4.32 40.39,4.32 40.89,4.83 40.89,6.35 40.26,6.99 J5.10
REGINPUTS  (via drill 0.51)
  Top 0.406: C3.1 47.84,30.14 48.26,29.72 v52.83,29.72
  Top 0.61: U1.3 50.01,31.5 C3.1 | U2.3 50.22,15.47 50.04,15.29
  Bottom 0.406: v52.83,14.73 v52.83,29.72
  pour Top (isolate 0.305): 46.99,15.24 53.34,15.24 53.34,11.43 46.99,11.43
RXD
  Top 0.254: U3.51 20.67,11.27 19.81,10.41 19.81,3.3 J9.P$3
SDCD  (via drill 0.38)
  Top 0.254: 15.75,41.91 16,41.66 15.99,41.66 J12.CD2 | 15.98,41.4 J12.CD2 | J12.CD1 J12.CD2 | v6.86,37.85 14.48,37.85 15.98,39.35 15.98,41.4 | 15.98,41.4 18.2,41.4 R18.1 | U3.49 17.87,14.82 17.78,14.73 v17.27,14.73
  Bottom 0.254: v6.86,37.85 7.11,37.59 7.11,34.8 6.6,34.29 6.6,27.18 5.84,27.18 5.33,26.67 5.33,25.15 9.14,21.34 9.14,20.32 10.92,18.54 10.92,17.78 13.72,14.99 16.51,14.99 16.76,14.73 v17.27,14.73
SDCLK  (via drill 0.38)
  Top 0.254: U3.40 17.03,19.32 16.26,18.54 13.46,18.54 11.43,20.57 v11.43,21.34 | J12.CLK 8.35,44.74 v8.38,44.7
  Bottom 0.254: v8.38,44.7 9.14,43.94 9.14,33.78 8.64,33.27 8.64,30.73 9.14,30.23 9.14,24.38 11.43,22.1 v11.43,21.34
SDCMD  (via drill 0.38)
  Top 0.254: J12.CMD v8.01,42.54 | U3.79 30.66,15.82 28.45,18.03 21.84,18.03 v21.34,17.53 | R23.1 7.24,29.97 7.75,29.46 v8.38,29.46
  Bottom 0.254: v8.01,42.54 8.64,41.91 8.64,34.04 8.13,33.53 8.13,30.48 8.64,29.97 8.64,29.46 | 8.64,29.46 8.64,24.13 10.67,22.1 10.67,21.08 13.72,18.03 20.07,18.03 20.57,17.53 v21.34,17.53 | v8.38,29.46 8.64,29.46
SDD0  (via drill 0.38)
  Top 0.254: J12.DAT0 7.82,46.94 v7.87,46.99 | U3.82 31.19,17.32 29.72,18.8 28.96,18.8 28.7,18.54 23.11,18.54 22.86,18.8 21.59,18.8 v21.34,18.54 | R21.1 8.64,31.24 8.89,30.99 v9.4,30.99
  Bottom 0.254: v7.87,46.99 9.14,46.99 9.65,46.48 9.65,33.53 9.14,33.02 9.14,32 9.65,31.5 9.65,30.99 | 9.65,30.99 9.65,24.64 12.19,22.1 12.19,20.32 13.97,18.54 v21.34,18.54 | v9.4,30.99 9.65,30.99
SDD1  (via drill 0.38)
  Top 0.254: J12.DAT1 9.62,48.04 v10.16,47.5 | U3.83 31.46,17.82 29.97,19.3 28.7,19.3 28.45,19.05 23.37,19.05 23.11,19.3 21.08,19.3 v20.83,19.56 | R22.1 v9.91,32.51
  Bottom 0.254: v10.16,47.5 10.16,32.51 | 10.16,32.51 10.16,24.89 12.7,22.35 12.7,20.57 14.22,19.05 20.32,19.05 v20.83,19.56 | v9.91,32.51 10.16,32.51
SDD2  (via drill 0.38)
  Top 0.254: J12.DAT2 6.91,40.34 v7.37,39.88 | U3.42 16.8,18.32 16.51,18.03 11.94,18.03 v11.68,18.29 | R19.1 5.71,27.43 6.1,27.05 v6.1,26.42
  Bottom 0.254: v7.37,39.88 7.62,39.62 7.62,34.54 7.11,34.04 7.11,27.43 7.62,26.92 7.62,26.42 | 7.62,26.42 7.62,23.62 9.65,21.59 9.65,20.57 11.68,18.54 v11.68,18.29 | v6.1,26.42 7.62,26.42
SDD3  (via drill 0.38)
  Top 0.254: J12.CD/DAT3 7.59,41.44 v7.87,41.15 | R20.1 6.48,28.7 7.24,27.94 v7.87,27.94 | U3.50 19.65,14.32 v20.83,15.49
  Bottom 0.254: v7.87,41.15 8.13,40.89 8.13,34.29 7.62,33.78 7.62,28.96 8.13,28.45 8.13,27.94 | 8.13,27.94 8.13,23.88 10.16,21.84 10.16,20.83 12.45,18.54 12.45,17.02 13.97,15.49 v20.83,15.49 | v7.87,27.94 8.13,27.94
SHIELD  (via drill 0.38)
  other vias: 1.91,24.51 1.91,20.83 1.91,17.14
  pour Top (isolate 0.305): 0,15.75 3.81,15.75 3.81,25.91 0,25.91
  pour Bottom (isolate 0.305): 3.81,15.75 0,15.75 0,25.91 3.81,25.91
SWCLK/TCK  (via drill 0.38)
  Top 0.254: R9.1 v22.86,8.38 22.86,9.65 v23.37,10.16 | U3.63 26.67,11.43 v25.91,10.67
  Bottom 0.254: J5.4 35.56,7.11 34.8,7.87 28.19,7.87 27.94,7.62 TP6.P$1 26.16,8.13 23.11,8.13 v22.86,8.38 | v25.91,10.67 23.88,10.67 v23.37,10.16
SWDIO/TMS  (via drill 0.38)
  Top 0.254: R6.1 v21.34,8.13 21.34,9.91 TP5.P$1 22.35,10.16 23.67,11.48 U3.57
  Bottom 0.254: J5.2 34.16,6.99 34.04,6.86 25.4,6.86 24.64,7.62 21.84,7.62 v21.34,8.13
TDI  (via drill 0.38)
  Top 0.254: v37.59,9.14 37.59,7.49 J5.8 | U3.74 32.17,11.01 TP8.P$1
  Bottom 0.254: v37.59,9.14 34.04,9.14 TP8.P$1
TDMI  (via drill 0.38)
  Top 0.254: U3.46 19.75,16.32 19.81,16.26 25.65,16.26 v26.16,16.76 | R24.1 27.69,48.26 v27.18,47.75
  Bottom 0.254: v26.16,16.76 25.91,17.02 25.91,20.57 26.92,21.59 26.92,22.1 26.67,22.35 26.67,24.38 27.94,25.65 27.94,30.73 27.69,30.99 27.69,42.42 27.43,42.67 27.43,47.5 v27.18,47.75
TDMI_C  (via drill 0.38)
  Top 0.254: U4.42 42.17,58.67 v43.69,57.15 | R24.2 32.26,48.26 33.02,49.02 41.66,49.02 42.42,49.78 v42.67,49.78
  Bottom 0.254: v43.69,57.15 43.69,51.31 42.67,50.29 v42.67,49.78
TDMO  (via drill 0.38)
  Top 0.254: v26.16,21.84 25.91,22.1 23.37,22.1 22.61,21.34 19.81,21.34 19.8,21.32 U3.36 | R28.1 v26.92,49.53
  Bottom 0.254: v26.16,21.84 26.16,24.64 27.43,25.91 27.43,30.48 27.18,30.73 27.18,42.16 26.92,42.42 26.92,46.99 26.42,47.5 26.42,49.02 v26.92,49.53
TDMO_C
  Top 0.254: U4.7 43.43,51.56 41.4,49.53 R28.2
TDO  (via drill 0.38)
  Top 0.254: U3.77 33.44,14.82 v33.27,14.99 | TP7.P$1 J5.6
  Bottom 0.254: v33.27,14.99 36.32,14.99 36.83,14.48 TP7.P$1
TXD  (via drill 0.38)
  Top 0.254: J9.P$2 15.75,1.27 17.53,3.05 18.8,3.05 19.3,3.56 19.3,10.67 20.07,11.43 20.07,13.46 v22.1,15.49 | U3.23 21.67,27.26 21.34,26.92 20.07,26.92 19.81,27.18 | 19.81,27.18 19.56,27.43 | 19.81,27.18 v19.56,27.18
  Bottom 0.254: v22.1,15.49 22.86,16.26 22.86,18.8 22.1,19.56 22.1,21.59 22.35,21.84 22.35,22.61 19.81,25.15 19.81,27.18 v19.56,27.18
UIA1  (via drill 0.38)
  Top 0.254: v25.4,41.4 25.65,41.66 64.77,41.66 66.55,39.88 66.55,36.32 J10.7 | U3.17 24.67,30.77 v25.4,31.5
  Bottom 0.254: v25.4,31.5 25.65,31.75 25.65,41.15 v25.4,41.4
UIA2  (via drill 0.38)
  Top 0.254: v22.86,41.15 23.88,42.16 65.02,42.16 67.06,40.13 67.06,38.35 J10.5 | U3.20 23.17,30.17 v22.86,30.48
  Bottom 0.254: v22.86,30.48 23.11,30.48 23.11,36.07 22.86,36.32 v22.86,41.15
UIA3  (via drill 0.38)
  Top 0.254: v22.86,42.67 65.28,42.67 J10.3 | U3.21 22.67,27.11 v22.86,26.92
  Bottom 0.254: v22.86,26.92 21.84,27.94 21.84,41.66 v22.86,42.67
UIA4  (via drill 0.38)
  Top 0.254: v25.65,43.43 25.91,43.18 67.31,43.18 J10.1 | U3.16 25.17,30 v25.65,30.48
  Bottom 0.254: v25.65,30.48 26.16,30.99 26.16,41.66 25.65,42.16 v25.65,43.43
UID1  (via drill 0.38)
  Top 0.254: v47.75,6.86 47.5,6.6 46.74,6.6 44.2,4.06 34.04,4.06 30.73,7.37 28.45,7.37 26.67,9.14 26.67,10.41 27.67,11.41 U3.65
  Bottom 0.254: J11.15 65.02,7.37 49.02,7.37 48.51,6.86 v47.75,6.86
UID2  (via drill 0.38)
  Top 0.254: v28.45,14.22 28.96,14.22 29.72,13.46 29.67,13.41 U3.69 | v46.23,7.11 43.69,4.57 34.29,4.57 30.99,7.87 28.7,7.87 27.43,9.14 v27.43,10.16
  Bottom 0.254: J11.13 67.06,7.87 48.77,7.87 48.51,7.62 46.99,7.62 46.48,7.11 v46.23,7.11 | v28.45,14.22 28.45,11.18 v27.43,10.16
UID3  (via drill 0.38)
  Top 0.254: U3.78 35.48,15.32 35.56,15.24 37.85,15.24 v38.1,15.49 | v41.4,12.95 41.66,12.95 44.7,9.91 44.7,9.65 v46.23,8.13
  Bottom 0.254: v38.1,15.49 39.37,15.49 40.39,14.48 40.39,13.72 40.89,13.21 41.15,13.21 v41.4,12.95 41.66,12.95 | J11.11 66.8,8.89 66.29,8.38 46.48,8.38 v46.23,8.13
UID4  (via drill 0.38)
  Top 0.254: U3.80 35.75,16.32 v36.07,16 | v41.15,13.97 41.4,13.97 45.21,10.16 45.21,9.91 45.97,9.14 v46.23,9.14
  Bottom 0.254: v36.07,16 36.32,16.26 38.35,16.26 38.61,16 39.62,16 41.15,14.48 v41.15,13.97 | J11.9 66.04,8.89 46.74,8.89 46.48,9.14 v46.23,9.14
UID5  (via drill 0.38)
  Top 0.254: U3.84 35.53,18.32 35.56,18.29 36.07,18.29 36.32,18.54 39.62,18.54 40.64,17.53 40.64,15.49 v45.97,10.16
  Bottom 0.254: J11.7 64.01,9.4 46.99,9.4 46.23,10.16 v45.97,10.16
UID6  (via drill 0.38)
  Top 0.254: U3.85 35.54,18.82 35.56,18.8 35.81,18.8 36.07,19.05 39.88,19.05 41.15,17.78 41.15,15.75 45.97,10.92 46.48,10.92 v46.99,10.41
  Bottom 0.254: J11.5 61.98,9.91 47.5,9.91 v46.99,10.41
UID7  (via drill 0.38)
  Top 0.254: J11.3 67.82,19.05 66.8,20.07 66.8,24.38 65.79,25.4 50.04,25.4 v49.78,25.15 | U3.87 35.55,19.82 35.56,19.81 v37.34,19.81
  Bottom 0.254: v37.34,19.81 37.34,20.83 39.12,22.61 42.42,22.61 44.45,24.64 48.01,24.64 48.26,24.89 49.28,24.89 49.53,25.15 v49.78,25.15
UID8  (via drill 0.38)
  Top 0.254: J11.1 67.31,22.86 67.31,24.64 66.04,25.91 49.02,25.91 v48.77,25.65 | v36.58,20.57 36.32,20.32 U3.88
  Bottom 0.254: v36.58,20.57 36.58,20.83 38.86,23.11 42.16,23.11 44.2,25.15 47.75,25.15 48.01,25.4 48.51,25.4 v48.77,25.65
UID9  (via drill 0.38)
  Top 0.254: J10.15 66.29,26.42 48.26,26.42 v48.01,26.16 | U3.89 33.79,20.82 33.78,20.83 33.53,20.83 v33.02,20.32
  Bottom 0.254: v48.01,26.16 47.5,25.65 43.94,25.65 41.91,23.62 38.61,23.62 35.81,20.83 33.53,20.83 v33.02,20.32
UID10  (via drill 0.38)
  Top 0.254: J10.13 66.8,26.67 66.55,26.92 47.5,26.92 v46.99,26.42 | U3.91 33.55,21.82 33.53,21.84 33.27,21.84 33.02,21.59 v33.02,21.34
  Bottom 0.254: v33.02,21.34 35.56,21.34 38.35,24.13 41.66,24.13 43.69,26.16 46.74,26.16 v46.99,26.42
UID11  (via drill 0.38)
  Top 0.254: v46.99,27.43 65.02,27.43 66.8,29.21 J10.11 | U3.92 35.78,22.32 36.07,22.61 v36.07,23.88
  Bottom 0.254: v36.07,23.88 36.07,24.89 36.58,25.4 37.08,25.4 37.34,25.15 40.39,25.15 41.4,26.16 42.93,26.16 43.43,26.67 46.23,26.67 v46.99,27.43
UID12  (via drill 0.38)
  Top 0.254: J10.9 64.77,27.94 47.5,27.94 v46.99,28.45 | U3.1 32.67,29.11 33.02,29.46 33.53,29.46 v34.54,28.45
  Bottom 0.254: v46.99,28.45 45.72,27.18 43.18,27.18 42.67,26.67 41.15,26.67 40.13,25.65 37.59,25.65 37.34,25.91 37.08,25.91 v34.54,28.45
USERSW  (via drill 0.38)
  Top 0.254: U3.26 17.88,26.32 17.78,26.42 12.45,26.42 v11.94,26.92 | S3.3 12.06,60.07 11.18,60.96 4.28,60.96 S4.2
  Bottom 0.254: v11.94,26.92 11.18,27.69 11.18,46.48 11.43,46.74 11.43,48.01 7.11,52.32 7.11,52.58 6.6,53.09 5.59,53.09 2.54,56.13 S4.2
VBDET
  Top 0.254: U3.47 16.02,15.82 R5.2 R4.1
VBUS  (via drill 0.38)
  Top 0.254: C2.1 R4.2 10.92,14.73 9.4,13.21 v9.4,12.45
  Top 0.406: v32,3.56 44.45,3.56 46.99,6.1 48.77,6.1 49.53,6.86 D1.A | J4.VBUS 5.87,22.13 v6.1,22.35
  Bottom 0.254: v9.4,12.45 9.65,12.7
  Bottom 0.406: v32,3.56 18.8,3.56 9.65,12.7 6.6,15.75 6.6,21.84 v6.1,22.35
VCCA  (via drill 0.38, 0.51)
  Top 0.254: 56.39,33.98 U1.4 | C38.1 34.54,62.48 36.32,62.48 C37.1 36.16,62.65 37.64,61.17 U4.37 41.95,61.17 44.95,58.17 U4.18 48.52,58.17 48.77,58.42 C31.1
  Top 0.406: R11.2 v56.73,40.55 | C31.1 C32.1 v49.95,54.27
  Top 0.61: 56.73,34.33 U1.4 U1.2 | C32.1 50.04,55.97
  Bottom 0.406: v56.73,40.55 56.73,42.33 55.63,43.43 36.58,43.43 36.32,43.69 JP1.1 JP1.2 36.32,46.74 36.83,47.24 45.97,47.24 46.99,48.26 50.8,48.26 50.8,53.42 v49.95,54.27
  other vias: 52.83,37.85 56.13,37.85 60.45,38.61 60.45,35.81 60.45,33.02 56.9,30.99 54.86,30.99 52.83,30.99
  pour Bottom: 60.96,30.48 60.96,39.12 52.32,39.12 52.32,30.48
  pour Top: 46.99,30.48 46.99,39.12 60.96,39.12 60.96,30.48
VDDOUT  (via drill 0.38)
  Top 0.254: C22.1 37.15,14.32 U3.76 33.62,14.32 33.53,14.22 33.02,14.22 32,15.24 30.48,15.24 28.19,17.53 25.4,17.53 v25.15,17.27 | C17.1 24.17,32.39 U3.18 24.17,25.61 v25.4,24.38 29.97,24.38 31.17,25.58 U3.4 31.17,30.41 31.24,30.48 C24.1 C25.1 FB2.2 FB1.2 | C18.1 22.1,30.48 22.17,30.41 U3.22 22.17,26.23 v22.1,26.16 | C21.1 16.76,20.07 17.01,19.82 U3.39 20.07,19.82 20.57,20.32 21.08,20.32 21.59,19.81 v25.15,19.81
  Bottom 0.254: v22.1,26.16 23.11,25.15 24.64,25.15 v25.4,24.38 24.89,23.88 24.89,21.08 25.15,20.83 v25.15,19.81 v25.15,17.27
VIN
  Top 0.406: Q1.3 J1.2 J1.1

## Text on the board
Bottom: V11
tPlace: 4 | 5 | 4 | 2 | 5 | 1L | IN | OUT | Tsunami | MIDI | Super WAV Trigger | 1R | 2L | AGND | USER | 2R | AUDIO OUT | 3L | AGND | 3R | 4L | STATUS | 4R | 1L | IN | 1R | A4 | 16 | A3 | 15 | robertsonics | A2 | 14 | A1 | 13 | 3.3V_A | 12 | 11 | PLAYING | 10 | 9 | TRIGGER IN | GND | 8 | 7 | 3.3V | 6 | 5 | RESET | 4 | 3 | 2 | VIN 5-15 VDC | FTDI | 1 | GND | VIN
bPlace: 4 | 5 | 4 | 2 | 5 | 1L | IN | OUT | Tsunami | MIDI | Super WAV Trigger | 1R | 2L | AGND | 2R | AUDIO OUT | 3L | AGND | 3R | 4L | 4R | 1L | IN | 1R | A4 | 16 | A3 | 15 | robertsonics | A2 | 14 | A1 | 13 | 3.3V_A | 12 | 11 | PLAYING | 10 | 9 | TRIGGER IN | GND | 8 | 7 | 6 | 3.3V | 5 | 4 | 3 | 2 | VIN 5-15 / VDC | 1 | GND | VIN
Measures: 4x 0.130" holes, to clear 4-40 screws. | All dimensions in inches.
tDocu: MCLK | BCLK | LRCK | TDMO | TDMI | APDN | DEBUG | Jamie Robertson & Byron Jacquot
bDocu: DEBUG